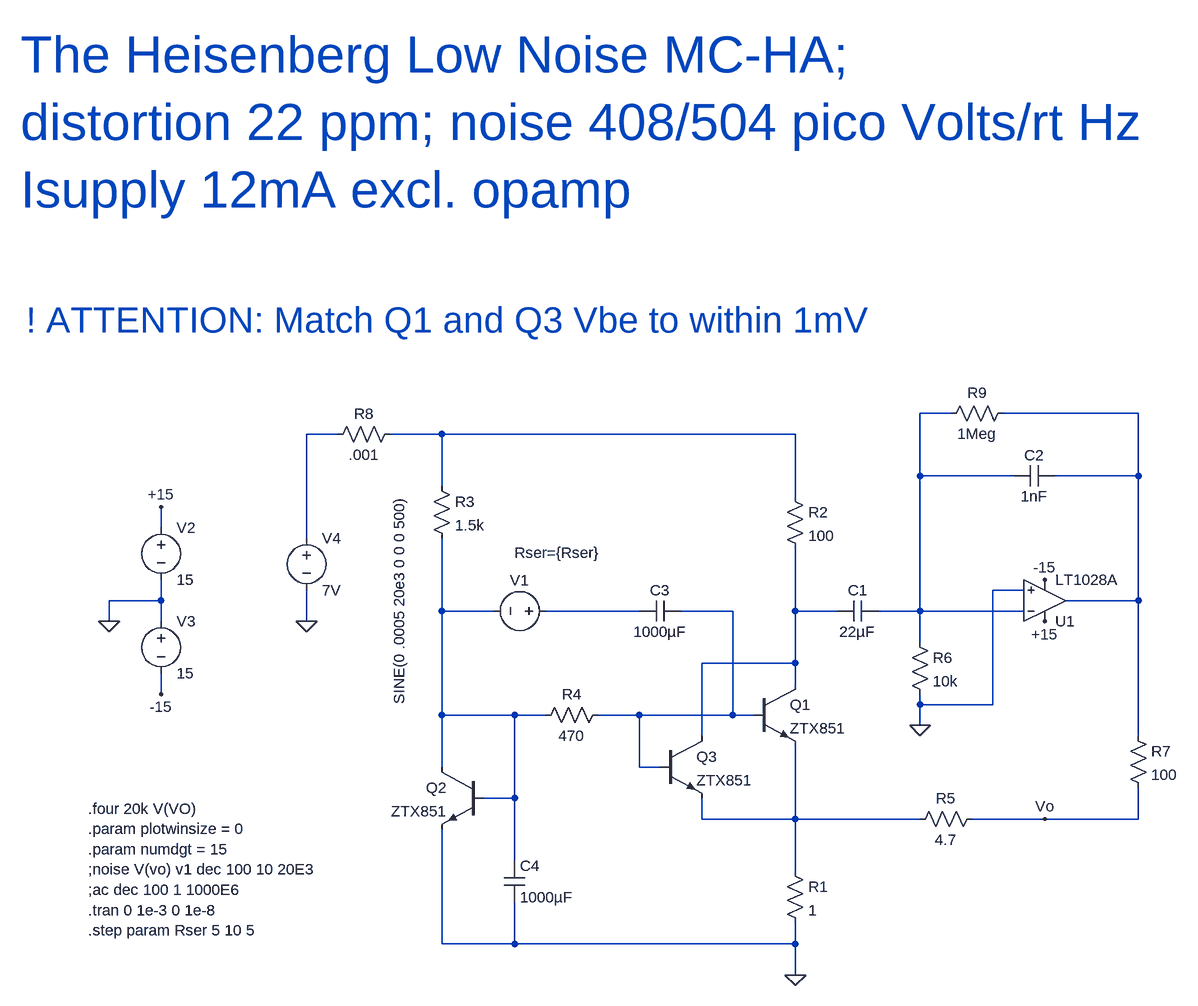
[diagram p0: schematic Heisenberg.asc]
Heisenberg.asc, the LTspice schematic file:
Version 4
SHEET 1 3352 680
WIRE 560 -288 512 -288
WIRE 848 -288 640 -288
WIRE -384 -256 -432 -256
WIRE -224 -256 -304 -256
WIRE 320 -256 -224 -256
WIRE 512 -192 512 -288
WIRE 656 -192 512 -192
WIRE 848 -192 848 -288
WIRE 848 -192 720 -192
WIRE -224 -176 -224 -256
WIRE 320 -160 320 -256
WIRE -656 -112 -656 -144
WIRE -432 -96 -432 -256
WIRE 672 -16 624 -16
WIRE -656 0 -656 -32
WIRE -656 0 -736 0
WIRE 848 0 848 -192
WIRE 848 0 736 0
WIRE -224 16 -224 -96
WIRE -144 16 -224 16
WIRE 80 16 -64 16
WIRE 224 16 144 16
WIRE 320 16 320 -80
WIRE 384 16 320 16
WIRE 512 16 512 -192
WIRE 512 16 448 16
WIRE 672 16 512 16
WIRE -736 32 -736 0
WIRE -656 32 -656 0
WIRE -432 32 -432 -16
WIRE 512 64 512 16
WIRE 320 96 320 16
WIRE 320 96 176 96
WIRE 320 128 320 96
WIRE -656 144 -656 112
WIRE 512 160 512 144
WIRE 624 160 624 -16
WIRE 624 160 512 160
WIRE -224 176 -224 16
WIRE -112 176 -224 176
WIRE -64 176 -112 176
WIRE 80 176 16 176
WIRE 224 176 224 16
WIRE 224 176 80 176
WIRE 256 176 224 176
WIRE 512 192 512 160
WIRE 176 208 176 96
WIRE 848 208 848 0
WIRE -224 256 -224 176
WIRE 80 256 80 176
WIRE 112 256 80 256
WIRE -112 304 -112 176
WIRE -112 304 -160 304
WIRE 176 336 176 304
WIRE 320 336 320 224
WIRE 320 336 176 336
WIRE 512 336 320 336
WIRE 704 336 592 336
WIRE 848 336 848 288
WIRE 848 336 704 336
WIRE -112 400 -112 304
WIRE 320 416 320 336
WIRE -224 528 -224 352
WIRE -112 528 -112 464
WIRE -112 528 -224 528
WIRE 320 528 320 496
WIRE 320 528 -112 528
WIRE 320 576 320 528
FLAG 320 576 0
FLAG -736 32 0
FLAG -656 -144 +15
FLAG -656 144 -15
FLAG 704 32 +15
FLAG 704 -32 -15
FLAG 512 192 0
FLAG -432 32 0
FLAG 704 336 Vo
SYMBOL npn 256 128 R0
SYMATTR InstName Q1
SYMATTR Value ZTX851
SYMBOL res 304 400 R0
SYMATTR InstName R1
SYMATTR Value 1
SYMBOL res 304 -176 R0
SYMATTR InstName R2
SYMATTR Value 100
SYMBOL npn -160 256 M0
SYMATTR InstName Q2
SYMATTR Value ZTX851
SYMBOL res -240 -192 R0
SYMATTR InstName R3
SYMATTR Value 1.5k
SYMBOL res 32 160 R90
WINDOW 0 0 56 VBottom 2
WINDOW 3 32 56 VTop 2
SYMATTR InstName R4
SYMATTR Value 470
SYMBOL voltage -48 16 R90
WINDOW 0 -32 56 VBottom 2
WINDOW 3 -17 226 Top 2
WINDOW 123 66 56 VTop 2
WINDOW 39 -105 -2 VTop 2
SYMATTR InstName V1
SYMATTR Value SINE(0 .0005 20e3 0 0 0 500)
SYMATTR SpiceLine Rser={Rser}
SYMBOL voltage -656 -128 R0
WINDOW 123 0 0 Left 2
WINDOW 39 0 0 Left 2
SYMATTR InstName V2
SYMATTR Value 15
SYMBOL voltage -656 16 R0
WINDOW 123 0 0 Left 2
WINDOW 39 0 0 Left 2
SYMATTR InstName V3
SYMATTR Value 15
SYMBOL Opamps\\LT1028A 704 64 M180
SYMATTR InstName U1
SYMBOL res 608 320 R90
WINDOW 0 0 56 VBottom 2
WINDOW 3 32 56 VTop 2
SYMATTR InstName R5
SYMATTR Value 4.7
SYMBOL cap 448 0 R90
WINDOW 0 0 32 VBottom 2
WINDOW 3 32 32 VTop 2
SYMATTR InstName C1
SYMATTR Value 22µF
SYMBOL res 496 48 R0
SYMATTR InstName R6
SYMATTR Value 10k
SYMBOL cap 720 -208 R90
WINDOW 0 0 32 VBottom 2
WINDOW 3 32 32 VTop 2
SYMATTR InstName C2
SYMATTR Value 1nF
SYMBOL voltage -432 -112 R0
WINDOW 123 0 0 Left 2
WINDOW 39 0 0 Left 2
SYMATTR InstName V4
SYMATTR Value 7V
SYMBOL res 832 192 R0
SYMATTR InstName R7
SYMATTR Value 100
SYMBOL cap 144 0 R90
WINDOW 0 0 32 VBottom 2
WINDOW 3 32 32 VTop 2
SYMATTR InstName C3
SYMATTR Value 1000µF
SYMBOL res -288 -272 R90
WINDOW 0 0 56 VBottom 2
WINDOW 3 32 56 VTop 2
SYMATTR InstName R8
SYMATTR Value .001
SYMBOL cap -128 400 R0
SYMATTR InstName C4
SYMATTR Value 1000µF
SYMBOL npn 112 208 R0
SYMATTR InstName Q3
SYMATTR Value ZTX851
SYMBOL res 656 -304 R90
WINDOW 0 0 56 VBottom 2
WINDOW 3 32 56 VTop 2
SYMATTR InstName R9
SYMATTR Value 1Meg
TEXT -768 320 Left 2 !.four 20k V(VO)\n.param plotwinsize = 0\n.param numdgt = 15\n;noise V(vo) v1 dec 100 10 20E3\n;ac dec 100 1 1000E6\n.tran 0 1e-3 0 1e-8\n.step param Rser 5 10 5
TEXT -872 -840 Left 6 ;The Heisenberg Low Noise MC-HA; \ndistortion 22 ppm; noise 408/504 pico Volts/rt Hz\nIsupply 12mA excl. opamp
TEXT -864 -432 Left 5 ;! ATTENTION: Match Q1 and Q3 Vbe to within 1mV

The netlist it stands for:
* Heisenberg.asc
Q1 N008 N007 N009 0 ZTX851
R1 N009 0 1
R2 N004 N008 100
Q2 N005 N005 0 0 ZTX851
R3 N004 N005 1.5k
R4 N007 N005 470
V1 N006 N005 SINE(0 .0005 20e3 0 0 0 500) Rser={Rser}
V2 +15 0 15
V3 0 -15 15
XU1 0 N001 +15 -15 N002 LT1028A  ; pins In+ In- V+ V- OUT
R5 Vo N009 4.7
C1 N001 N008 22µF
R6 N001 0 10k
C2 N002 N001 1nF
V4 N003 0 7V
R7 N002 Vo 100
C3 N007 N006 1000µF
R8 N004 N003 .001
C4 N005 0 1000µF
Q3 N008 N007 N009 0 ZTX851
R9 N002 N001 1Meg
.model NPN NPN
.model PNP PNP
.lib standard.bjt
.four 20k V(VO)
.param plotwinsize = 0
.param numdgt = 15
;noise V(vo) v1 dec 100 10 20E3
;ac dec 100 1 1000E6
.tran 0 1e-3 0 1e-8
.step param Rser 5 10 5
* The Heisenberg Low Noise MC-HA;
* distortion 22 ppm; noise 408/504 pico Volts/rt Hz
* Isupply 12mA excl. opamp
* ! ATTENTION: Match Q1 and Q3 Vbe to within 1mV
.backanno
.end